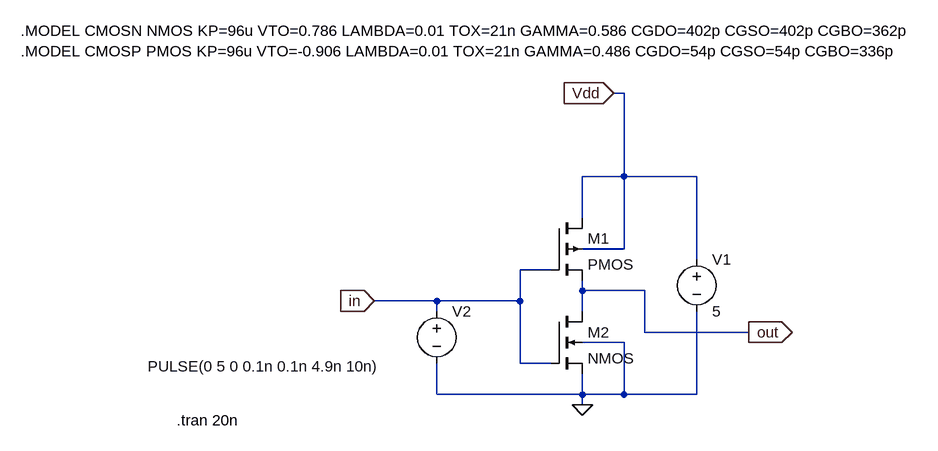
[diagram p0: schematic inverter  - ini.asc]
inverter  - ini.asc, the LTspice schematic file:
Version 4
SHEET 1 1024 680
WIRE 288 -144 272 -144
WIRE 288 -16 288 -144
WIRE 288 -16 224 -16
WIRE 400 -16 288 -16
WIRE 224 48 224 -16
WIRE 288 96 288 -16
WIRE 288 96 224 96
WIRE 400 112 400 -16
WIRE 176 128 128 128
WIRE 224 160 224 144
WIRE 320 160 224 160
WIRE 0 176 -96 176
WIRE 128 176 128 128
WIRE 128 176 0 176
WIRE 0 192 0 176
WIRE 224 192 224 160
WIRE 320 224 320 160
WIRE 480 224 320 224
WIRE 288 240 224 240
WIRE 128 272 128 176
WIRE 176 272 128 272
WIRE 0 320 0 272
WIRE 224 320 224 288
WIRE 224 320 0 320
WIRE 288 320 288 240
WIRE 288 320 224 320
WIRE 400 320 400 192
WIRE 400 320 288 320
WIRE 224 336 224 320
FLAG 224 336 0
FLAG 480 224 out
IOPIN 480 224 Out
FLAG 272 -144 Vdd
IOPIN 272 -144 In
FLAG -96 176 in
IOPIN -96 176 In
SYMBOL pmos4 176 48 R0
SYMATTR InstName M1
SYMATTR Value2 l=10u w=200u
SYMBOL nmos4 176 192 R0
SYMATTR InstName M2
SYMATTR Value2 l=10u w=100u
SYMBOL voltage 400 96 R0
WINDOW 123 0 0 Left 0
WINDOW 39 0 0 Left 0
SYMATTR InstName V1
SYMATTR Value 5
SYMBOL voltage 0 176 R0
WINDOW 3 -445 101 Left 2
WINDOW 123 0 0 Left 0
WINDOW 39 0 0 Left 0
SYMATTR Value PULSE(0 5 0 0.1n 0.1n 4.9n 10n)
SYMATTR InstName V2
TEXT -640 -240 Left 2 !.MODEL CMOSN NMOS KP=96u VTO=0.786 LAMBDA=0.01 TOX=21n GAMMA=0.586 CGDO=402p CGSO=402p CGBO=362p\n.MODEL CMOSP PMOS KP=96u VTO=-0.906 LAMBDA=0.01 TOX=21n GAMMA=0.486 CGDO=54p CGSO=54p CGBO=336p
TEXT -400 360 Left 2 !.tran 20n

The netlist it stands for:
* inverter  - ini.asc
M1 Vdd in out Vdd PMOS l=10u w=200u
M2 out in 0 0 NMOS l=10u w=100u
V1 Vdd 0 5
V2 in 0 PULSE(0 5 0 0.1n 0.1n 4.9n 10n)
.model NMOS NMOS
.model PMOS PMOS
.lib standard.mos
.MODEL CMOSN NMOS KP=96u VTO=0.786 LAMBDA=0.01 TOX=21n GAMMA=0.586 CGDO=402p CGSO=402p CGBO=362p
.MODEL CMOSP PMOS KP=96u VTO=-0.906 LAMBDA=0.01 TOX=21n GAMMA=0.486 CGDO=54p CGSO=54p CGBO=336p
.tran 20n
.backanno
.end